# Altium schematic sheet Adjustable_DCDC.SchDoc
size A3; SheetNumber: 3; SheetTotal: 5
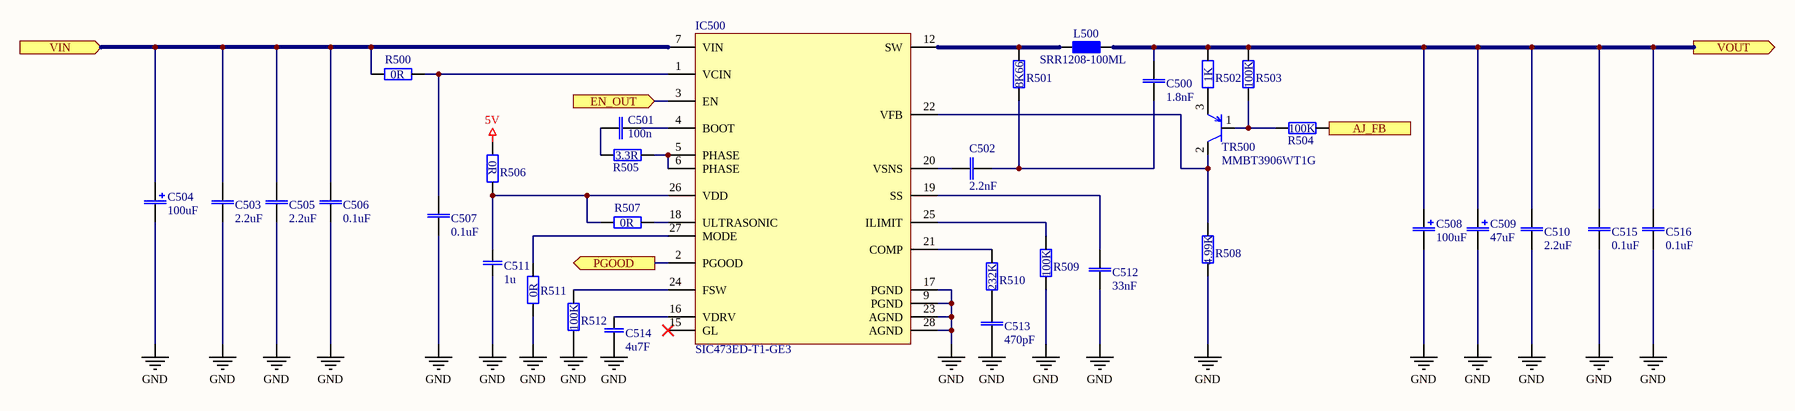
[diagram p0: Adjustable_DCDC.SchDoc]

## Parts
C500  1.8nF  [CAP0402]
C501  100n  [CAP0402]
C502  2.2nF  [CAP0402]
C503  2.2uF  [CAP1206]
C504  100uF  [CHEMICON_D10H10_JA0]
C505  2.2uF  [CAP0805]
C506  0.1uF  [CAP0402]
C507  0.1uF  [CAP0402]
C508  100uF  [CHEMICON_D10H10_JA0]
C509  47uF  [CHEMICON_KOND_D8H10]
C510  2.2uF  [CAP1206]
C511  1u  [0603]
C512  33nF  [CAP0402]
C513  470pF  [CAP0402]
C514  4u7F  [0805]
C515  0.1uF  [CAP0402]
C516  0.1uF  [CAP0402]
IC500  SIC473ED-T1-GE3  [VISCHAY_SiC47X]
L500  SRR1208-100ML  [SRR1208]
R500  0R  [RES0402]  (value not drawn)
R501  RC0402FR-078K66L  [RES0402]  (value not drawn)
R502  RC0402FR-071KL  [RES0402]  (value not drawn)
R503  RC0402FR-07100KL  [RES0402]  (value not drawn)
R504  RC0402FR-07100KL  [RES0402]  (value not drawn)
R505  RC0402FR-073R3L  [RES0402]  (value not drawn)
R506  0R  [RES0402]  (value not drawn)
R507  0R  [RES0402]  (value not drawn)
R508  RC0402FR-074K99L  [RES0402]  (value not drawn)
R509  RC0402FR-07100KL  [RES0402]  (value not drawn)
R510  RC0402FR-07232KL  [RES0402]  (value not drawn)
R511  0R  [RES0402]  (value not drawn)
R512  RC0402FR-07100KL  [RES0402]  (value not drawn)
TR500  MMBT3906WT1G  [SOT323/SC-70(NX6008NBKW)]

## Ports
AJ_FB (in, see OutputStage[3A]), EN_OUT (in, see OutputStage[3A], OutputStage[2A]), PGOOD (out, see OutputStage[3A], OutputStage[2A]), VIN (in, see OutputStage[3A]), VOUT (out, see OutputStage[3A])

## Nets
5V: R506.1
GND: C503.1 C504.2 C505.1 C506.1 C507.1 C508.2 C509.2 C510.1 C511.1 C512.1 C513.1 C514.1 C515.1 C516.1 IC500.9(PGND) IC500.17(PGND) IC500.23(AGND) IC500.28(AGND) R508.1 R509.1 R511.1 R512.1
AJ_FB: R504.2 ; port AJ_FB
EN_OUT: IC500.3(EN) ; port EN_OUT
PGOOD: IC500.2(PGOOD) ; port PGOOD
VIN: C503.2 C504.1 C505.2 C506.2 IC500.7(VIN) R500.1 ; port VIN
VOUT: C500.2 C508.1 C509.1 C510.2 C515.2 C516.2 L500.2 R502.2 R503.2 ; port VOUT
NetC500_1: C500.1 C502.2 R501.1
NetC501_1: C501.1 IC500.4(BOOT)
NetC501_2: C501.2 R505.1
NetC502_1: C502.1 IC500.20(VSNS)
NetC507_2: C507.2 IC500.1(VCIN) R500.2
NetC511_2: C511.2 IC500.26(VDD) R506.2 R507.1
NetC512_2: C512.2 IC500.19(SS)
NetC513_2: C513.2 R510.1
NetC514_2: C514.2 IC500.16(VDRV)
NetIC500_5: IC500.5(PHASE) IC500.6(PHASE) R505.2
NetIC500_12: IC500.12(SW) L500.1 R501.2
NetIC500_18: IC500.18(ULTRASONIC) R507.2
NetIC500_21: IC500.21(COMP) R510.2
NetIC500_22: IC500.22(VFB) R508.2 TR500.2(E)
NetIC500_24: IC500.24(FSW) R512.2
NetIC500_25: IC500.25(ILIMIT) R509.2
NetIC500_27: IC500.27(MODE) R511.2
NetR502_1: R502.1 TR500.3(C)
NetR503_1: R503.1 R504.1 TR500.1(B)

Not connected (* = marked no-connect by the designer): IC500 15(GL)*

## Notes on the sheet
- (near C512) Current Limit with 100K approx 4A

## Library data of the parts
C500 = CC0402KPX7R9BB182: MaxVoltage: 50V; Value: 1.8nF; MPN: CC0402KPX7R9BB182
C501 = CL05A104KA5NNNC: MaxVoltage: 25V; Dialectric: X5R; Tolerance: 10%; Value: 100n; MPN: CL05A104KA5NNNC
C502 = CC0402KRX7R9BB222: MaxVoltage: 50V; Value: 2.2nF; MPN: CC0402KRX7R9BB222
C503 C510 = CL31B225KCHSNNE: MaxVoltage: 100V; Value: 2.2uF; MPN: CL31B225KCHSNNE
C504 C508 = EMVE630ARA101MJA0G: MaxVoltage: 63V; Value: 100uF; MPN: EMVE630ARA101MJA0G
C505 = GRM21BD72A225ME01K: 0805; MaxVoltage: 100V; Value: 2.2uF; MPN: GRM21BD72A225ME01K
C506 C507 C515 C516 = GRM155R62A104KE14D: 0805; MaxVoltage: 100V; Value: 0.1uF; MPN: GRM155R62A104KE14D
C509 = HHXC500ARA470MHA0G: MaxVoltage: 50V; Value: 47uF; MPN: HHXC500ARA470MHA0G
C511 = 000088: Part Number: 000088; Component Type: Standard; ComponentLink1Description: Datasheet; ComponentLink2Description: Manufacturer Site; Value: 1u
C512 = C0402C333K4RECTU: MaxVoltage: 16; Value: 33nF; MPN: C0402C333K4RECTU
C513 = CL05B471KB5NNNC: MaxVoltage: 50V; Value: 470pF; MPN: CL05B471KB5NNNC
C514 = 000090: Part Number: 000090; MPN: CL21A475KOFNNNE; Component Type: Standard; ComponentLink1Description: Datasheet; ComponentLink2Description: Manufacturer Site; Value: 4u7F; Digikey Number: 1276-1065-1-ND
R500 R506 R507 R511 = RES_0402: MPN: RC0402JR-070RL; Value: 0R
R501 = RC0402FR-078K66L: Value: 8K66; MPN: RC0402FR-078K66L
R502 = RC0402FR-071KL: Value: 1K; MPN: RC0402FR-071KL
R503 R504 R509 R512 = RC0402FR-07100KL: Value: 100K; MPN: RC0402FR-07100KL
R505 = RC0402FR-073R3L: Value: 3.3R; MPN: RC0402FR-073R3L
R508 = RC0402FR-074K99L: Value: 4.99K; MPN: RC0402FR-074K99L
R510 = RC0402FR-07232KL: Value: 232K; MPN: RC0402FR-07232KL
IC500 = SIC473ED-T1-GE3: MPN: SIC473ED-T1-GE3
L500 = SRR1208-100ML: MPN: SRR1208-100ML
TR500 = MMBT3906WT1G: MPN: MMBT3906WT1G